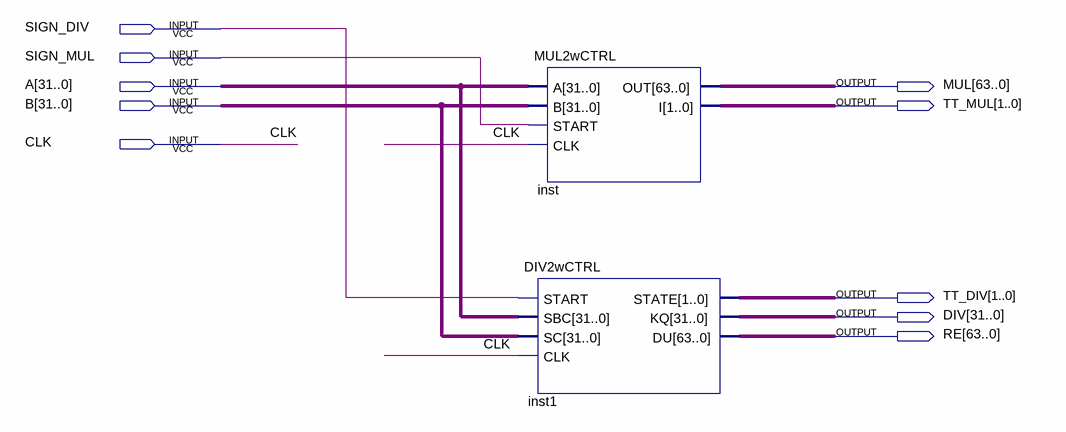
[diagram p0: schematic sheet]
// Quartus schematic PJMULandDIV.bdf as structural Verilog: 2 symbols, 10 pins
module PJMULandDIV (
  input  SIGN_DIV,
  input  SIGN_MUL,
  input  [31:0] A,
  input  [31:0] B,
  input  CLK,
  output [63:0] MUL,
  output [1:0] TT_MUL,
  output [1:0] TT_DIV,
  output [31:0] DIV,
  output [63:0] RE
);

  MUL2wCTRL inst (.A(A), .B(B), .START(SIGN_MUL), .CLK(CLK), .OUT(MUL), .I(TT_MUL));
  DIV2wCTRL inst1 (.START(SIGN_DIV), .SBC(A), .SC(B), .CLK(CLK), .STATE(TT_DIV), .KQ(DIV), .DU(RE));
endmodule
